# Altium project PCB_Project1.PrjPCB
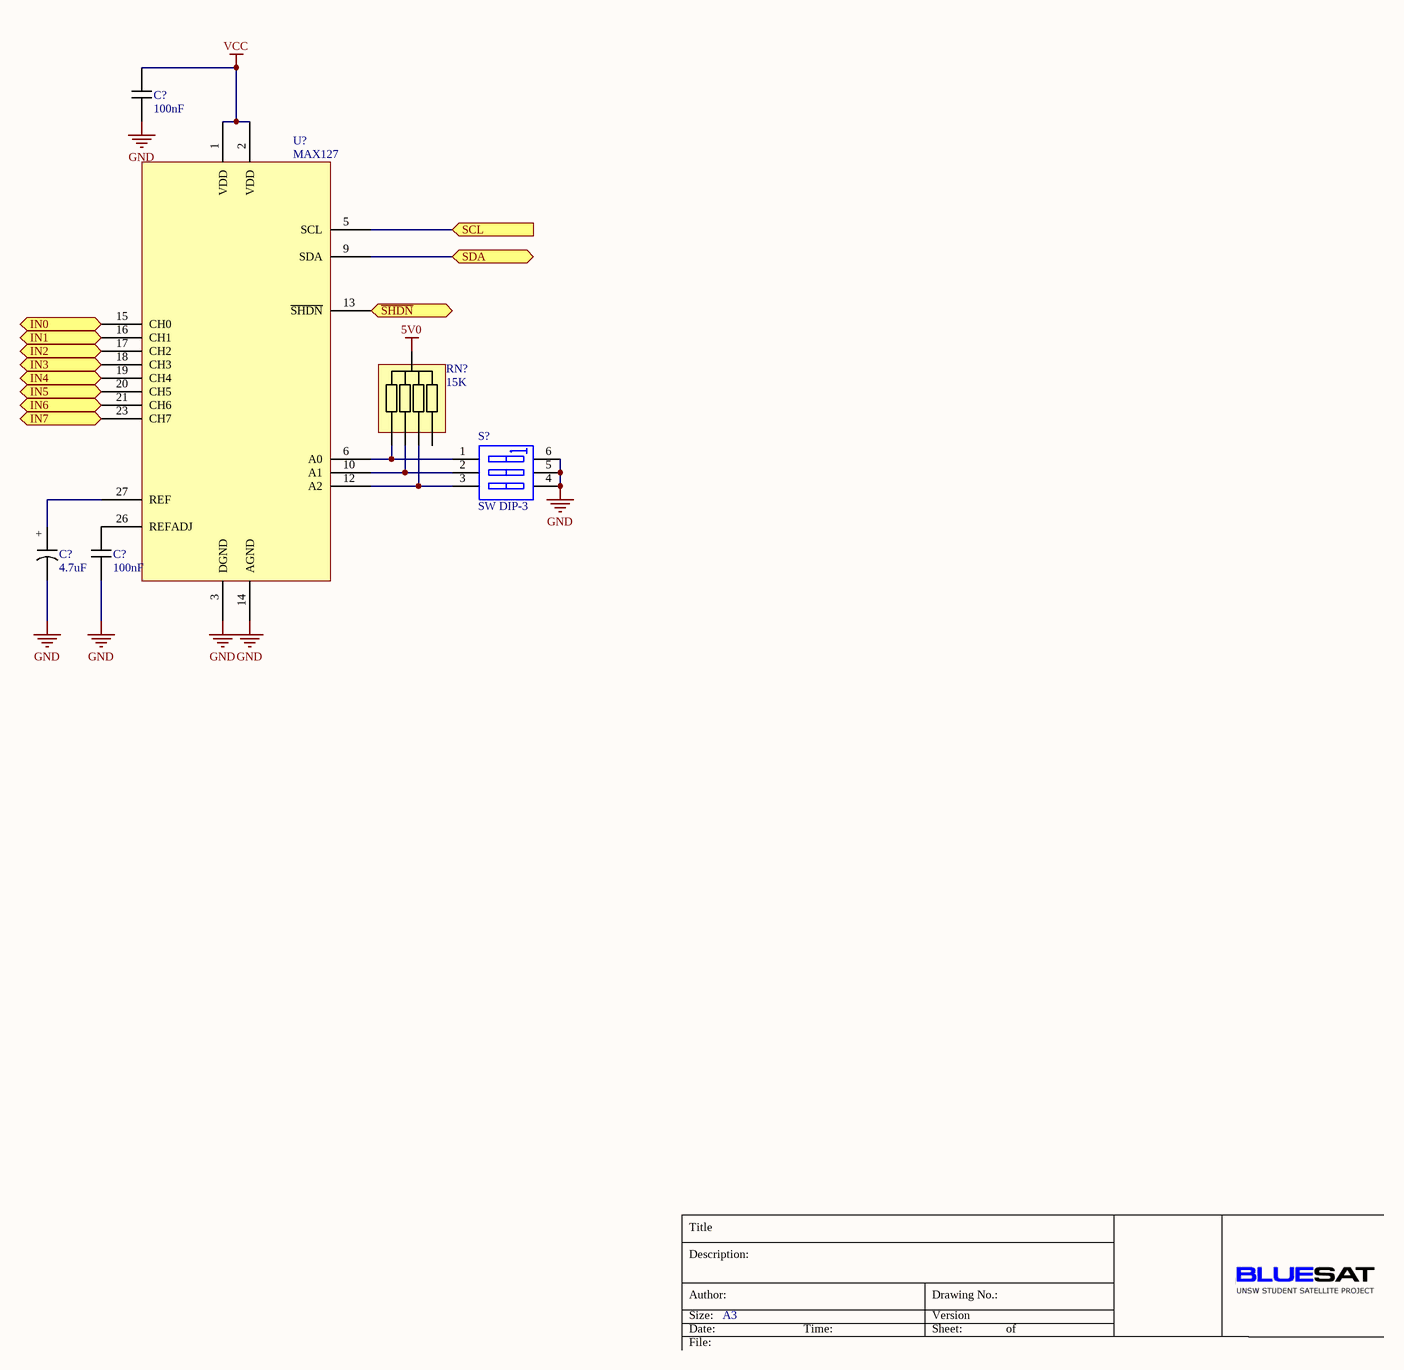
[diagram p0: TELM0002ADC.SchDoc]
3 sheets, 19 parts. Net scope: flat (ports and power ports of the same name join across sheets).
Sheets:
  TELM0002ADC.SchDoc
  TELM0003_TempSense.SchDoc
  TELM0004_CurrentSense.SchDoc

## Sheet TELM0002ADC.SchDoc: MAX127 Telemetry Circuit
size A3; Engineer: A. SHAW; Organization: BLUEsat Project; Address1: Room 419; Address2: School of EE&T; Address3: UNSW, NSW 2052; Address4: Australia; DocumentNumber: TELM0002; SheetNumber: 1; SheetTotal: 1; Description: Telemetry ADC Circuit; Version: 1.0

### Parts
(Parts that share a designator on the sheet are numbered #1, #2 ... from top to bottom, then left to right.)
C?#1  value 100nF  [0603 Cap]  (hidden comment: 0603 Cap)
C?#2  value 4.7uF  [0603 Cap]  (hidden comment: Cap)
C?#3  value 100nF  [0603 Cap]  (hidden comment: 0603 Cap)
RN?  value 15K  (hidden comment: RN4)
S?  SW DIP-3  [DIP-6]
U?  MAX127

### Ports
IN0 (in), IN1 (in), IN2 (in), IN3 (in), IN4 (in), IN5 (in), IN6 (in), IN7 (in), SCL (in), SDA (bidir), ~{SHDN} (in)

### Nets
5V0: RN?.1
GND: C?#1.1 C?#2.- C?#3.1 S?.4(B3) S?.5(B2) S?.6(B1) U?.3(DGND) U?.14(AGND)
VCC: C?#1.2 U?.1(VDD) U?.2(VDD)
NetC?#2_+: C?#2.+ U?.27(REF)
NetC?#3_2: C?#3.2 U?.26(REFADJ)
NetRN?_1: RN?.1 S?.1(A1) U?.6(A0)
NetRN?_1: RN?.1 S?.2(A2) U?.10(A1)  [a separate net that carries the same name]
NetRN?_1: RN?.1 S?.3(A3) U?.12(A2)  [a separate net that carries the same name]
NetU?_5: U?.5(SCL) ; port SCL
NetU?_9: U?.9(SDA) ; port SDA
NetU?_13: U?.13(~{SHDN}) ; port ~{SHDN}
NetU?_15: U?.15(CH0) ; port IN0
NetU?_16: U?.16(CH1) ; port IN1
NetU?_17: U?.17(CH2) ; port IN2
NetU?_18: U?.18(CH3) ; port IN3
NetU?_19: U?.19(CH4) ; port IN4
NetU?_20: U?.20(CH5) ; port IN5
NetU?_21: U?.21(CH6) ; port IN6
NetU?_23: U?.23(CH7) ; port IN7

### Notes on the sheet
- Title
- Description:
- Size:
- Author:
- Date:
- A3
- Time:
- Version
- Sheet:
- Drawing No.:
- of
- File:

### Library data of the parts
C?#1 C?#3 = 0603 MLCC - X7R, 10%
C?#2 = Polerised Capacitor
S? = SW DIP-3: DIP Switch, 3 Position, SPST; Published: 24-Mar-1999; LatestRevisionDate: 17-Jul-2002; LatestRevisionNote: Re-released for DXP Platform.; PackageReference: DIP-6; Publisher: Altium Limited; Code_JEDEC: MO-001-AM
U? = MAX127: 8 Channel, 12 bit, I2C DAS

## Sheet TELM0003_TempSense.SchDoc: Temperature Sensor Circuit
size A3; Engineer: A. SHAW; Organization: BLUEsat Project; Address1: Room 419; Address2: School of EE&T; Address3: UNSW, NSW 2052; Address4: Australia; DocumentNumber: TELM0003; SheetNumber: 1; SheetTotal: 1; Version: 1.0
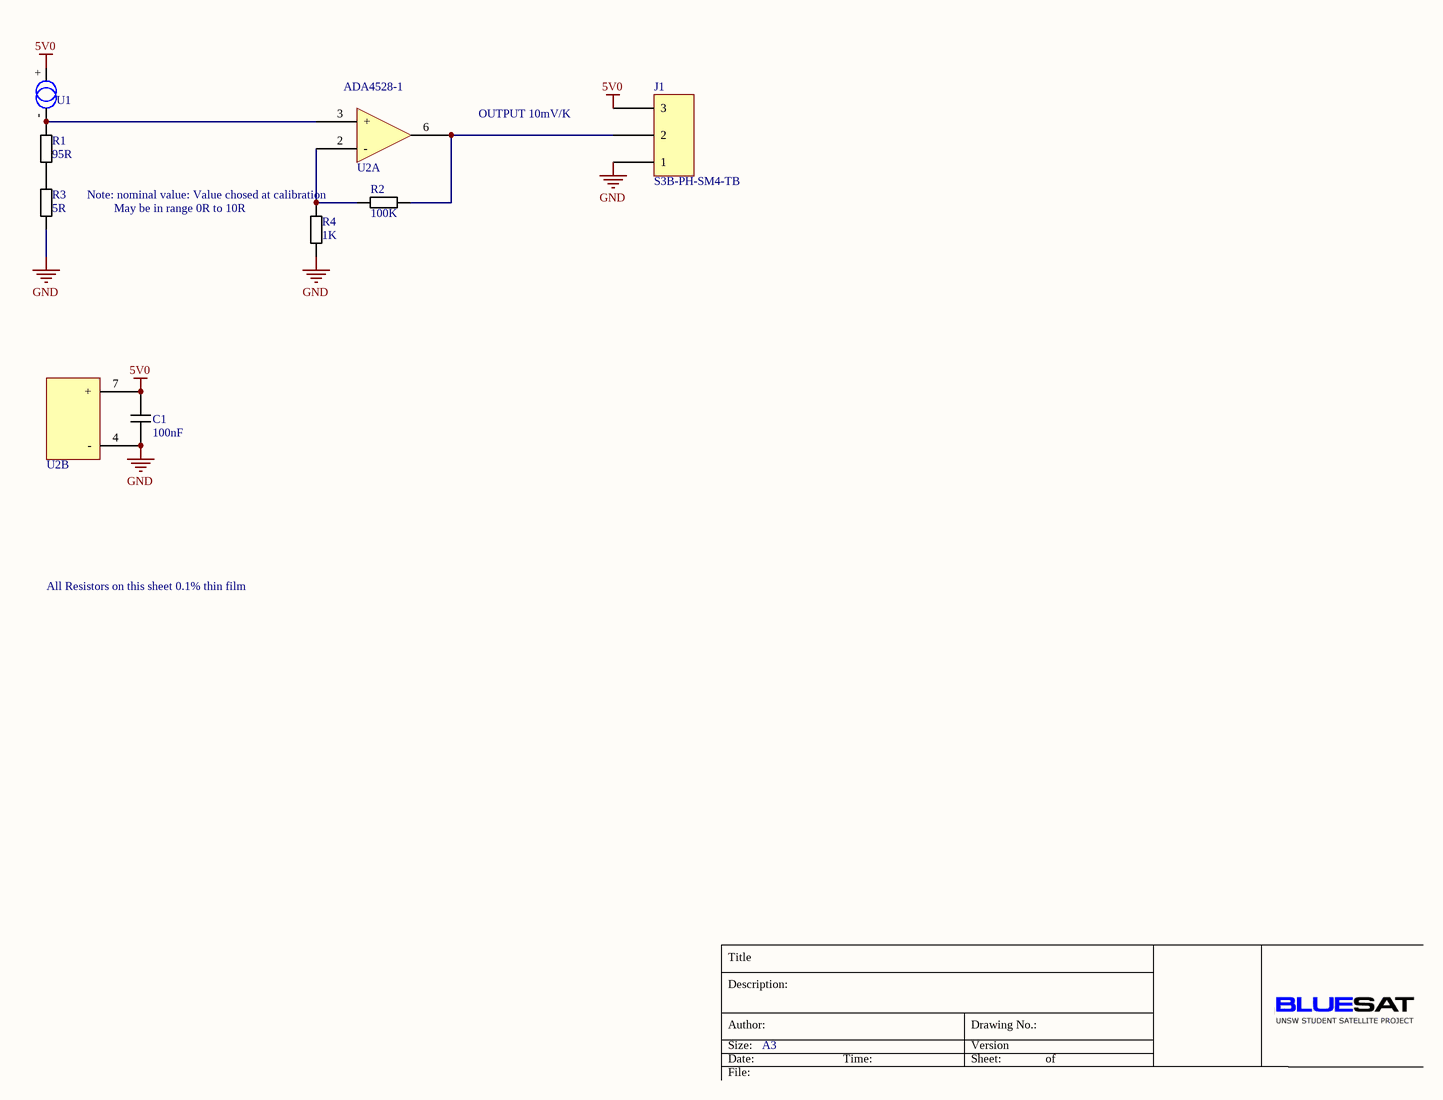
[diagram p1: TELM0003_TempSense.SchDoc]

### Parts
(Parts that share a designator on the sheet are numbered #1, #2 ... from top to bottom, then left to right.)
C1#1  value 100nF  [1206 Cap]  (hidden comment: 1206 Cap)
J1#1  S3B-PH-SM4-TB  [S3B-PH-SM4-TB]
R1#1  value 95R  [0603 Resistor]  (hidden comment: 0603 Resistor)
R2  value 100K  [0603 Resistor]  (hidden comment: 0603 Resistor)
R3  value 5R  [0603 Resistor]  (hidden comment: 0603 Resistor)
R4  value 1K  [0603 Resistor]  (hidden comment: 0603 Resistor)
U1#1  AD590KF  [5.05mm Terminal Block - 2]  (value not drawn)
U2  ADA4528-1  [SOIC8 - LME49720]  (parts A,B of 2)

### Nets
5V0: C1#1.2 J1#1.3 U1#1.+ U2.7(+)
GND: C1#1.1 J1#1.1 R3.1 R4.1 U2.4(-)
NetJ1#1_2: J1#1.2 R2.1 U2.6(Out)
NetR1#1_1: R1#1.1 R3.2
NetR1#1_2: R1#1.2 U1#1.- U2.3(+)
NetR2_2: R2.2 R4.2 U2.2(-)

### Notes on the sheet
- OUTPUT 10mV/K
- (near R2) Note: nominal value: Value chosed at calibration
- May be in range 0R to 10R
- All Resistors on this sheet 0.1% thin film
- Title
- Description:
- Size:
- Author:
- Date:
- A3
- Time:
- Version
- Sheet:
- Drawing No.:
- of
- File:

### Library data of the parts
C1#1 = 1206 MLCC - X7R, 10%
J1#1 = S3B-PH-SM4-TB: JST connector
R1#1 R2-R4 = 0603 Thin Film Resistor 0.1%
U1#1 = AD590KF: Temperature sensor IC; pin to pad: +>1 ->2
U2 = ADA4528-1: Dual, High Performance Audio Operational Amplifier; ComponentLink1Description: Datasheet; ComponentLink1URL: http://www.national.com/ds/LM/LME49720.pdf

## Sheet TELM0004_CurrentSense.SchDoc: Telemetry Current Sense
size A3; Engineer: A. SHAW; Organization: BLUEsat Project; Address1: Room 419; Address2: School of EE&T; Address3: UNSW, NSW 2052; Address4: Australia; DocumentNumber: TELM0004; SheetNumber: 1; SheetTotal: 1; Description: Converts Current to Voltage 500mV/A; Version: 1.0
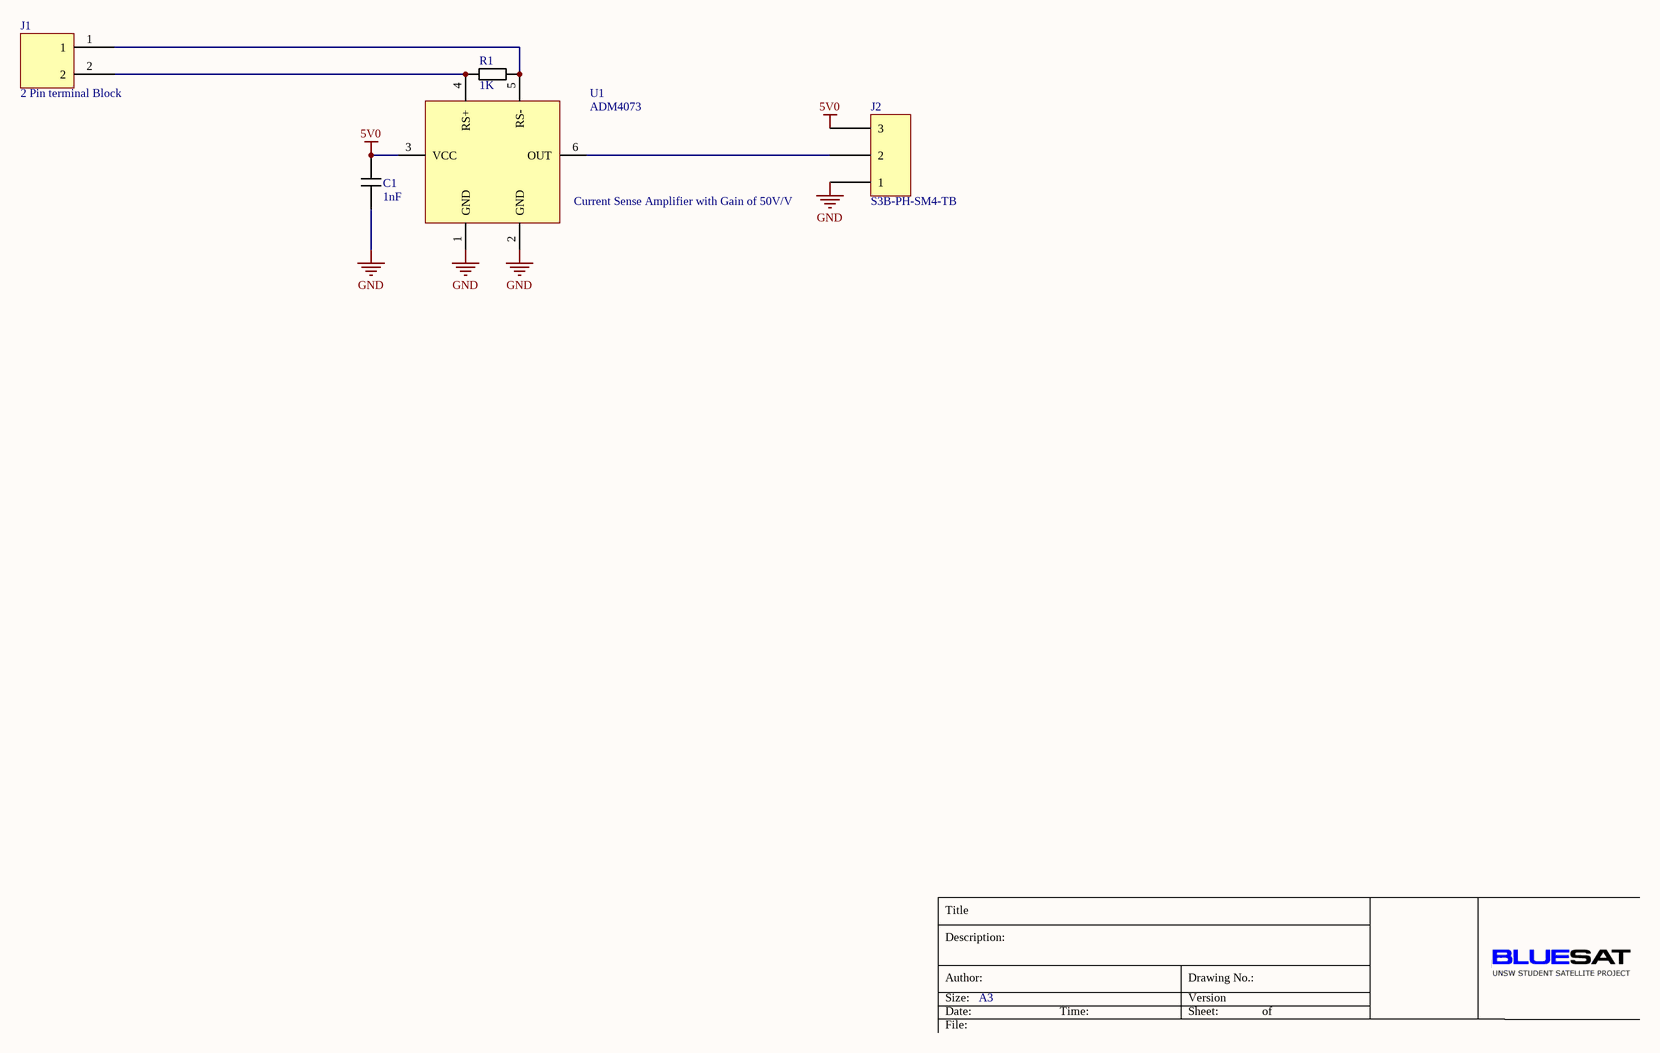
[diagram p2: TELM0004_CurrentSense.SchDoc]

### Parts
(Parts that share a designator on the sheet are numbered #1, #2 ... from top to bottom, then left to right.)
C1#2  value 1nF  [1206 Cap]  (hidden comment: 1206 Cap)
J1#2  2 Pin terminal Block  [5.05mm Terminal Block - 2]
J2  S3B-PH-SM4-TB  [S3B-PH-SM4-TB]
R1#2  value 1K  [0603 Resistor]  (hidden comment: 0603 Resistor)
U1#2  ADM4073  [SOT95P285X145-6N]

### Nets
5V0: C1#2.2 J2.3 U1#2.3(VCC)
GND: C1#2.1 J2.1 U1#2.1(GND) U1#2.2(GND)
NetJ1#2_1: J1#2.1 R1#2.2 U1#2.5(RS-)
NetJ1#2_2: J1#2.2 R1#2.1 U1#2.4(RS+)
NetJ2_2: J2.2 U1#2.6(OUT)

### Notes on the sheet
- (near U1#2) Current Sense Amplifier with Gain of 50V/V
- Title
- Description:
- Size:
- Author:
- Date:
- A3
- Time:
- Version
- Sheet:
- Drawing No.:
- of
- File:

### Library data of the parts
C1#2 = 1206 MLCC - X7R, 10%
J1#2 = 2 Terminal Block
J2 = S3B-PH-SM4-TB: JST connector
R1#2 = 0603 Thin Film Resistor 0.1%
U1#2 = ADM4073: Current Sense Amplifer

## Nets that join several sheets
5V0: TELM0002ADC (RN?.1), TELM0003_TempSense (C1#1.2 J1#1.3 U1#1.+ U2.7), TELM0004_CurrentSense (C1#2.2 J2.3 U1#2.3)
GND: TELM0002ADC (8 pins), TELM0003_TempSense (5 pins), TELM0004_CurrentSense (C1#2.1 J2.1 U1#2.1 U1#2.2)